# EAGLE design ict_to_hid (EAGLE 8.0.2)
AUTHOR: Brad Campbell; REV: A; TITLE: Bill Acceptor Adapter
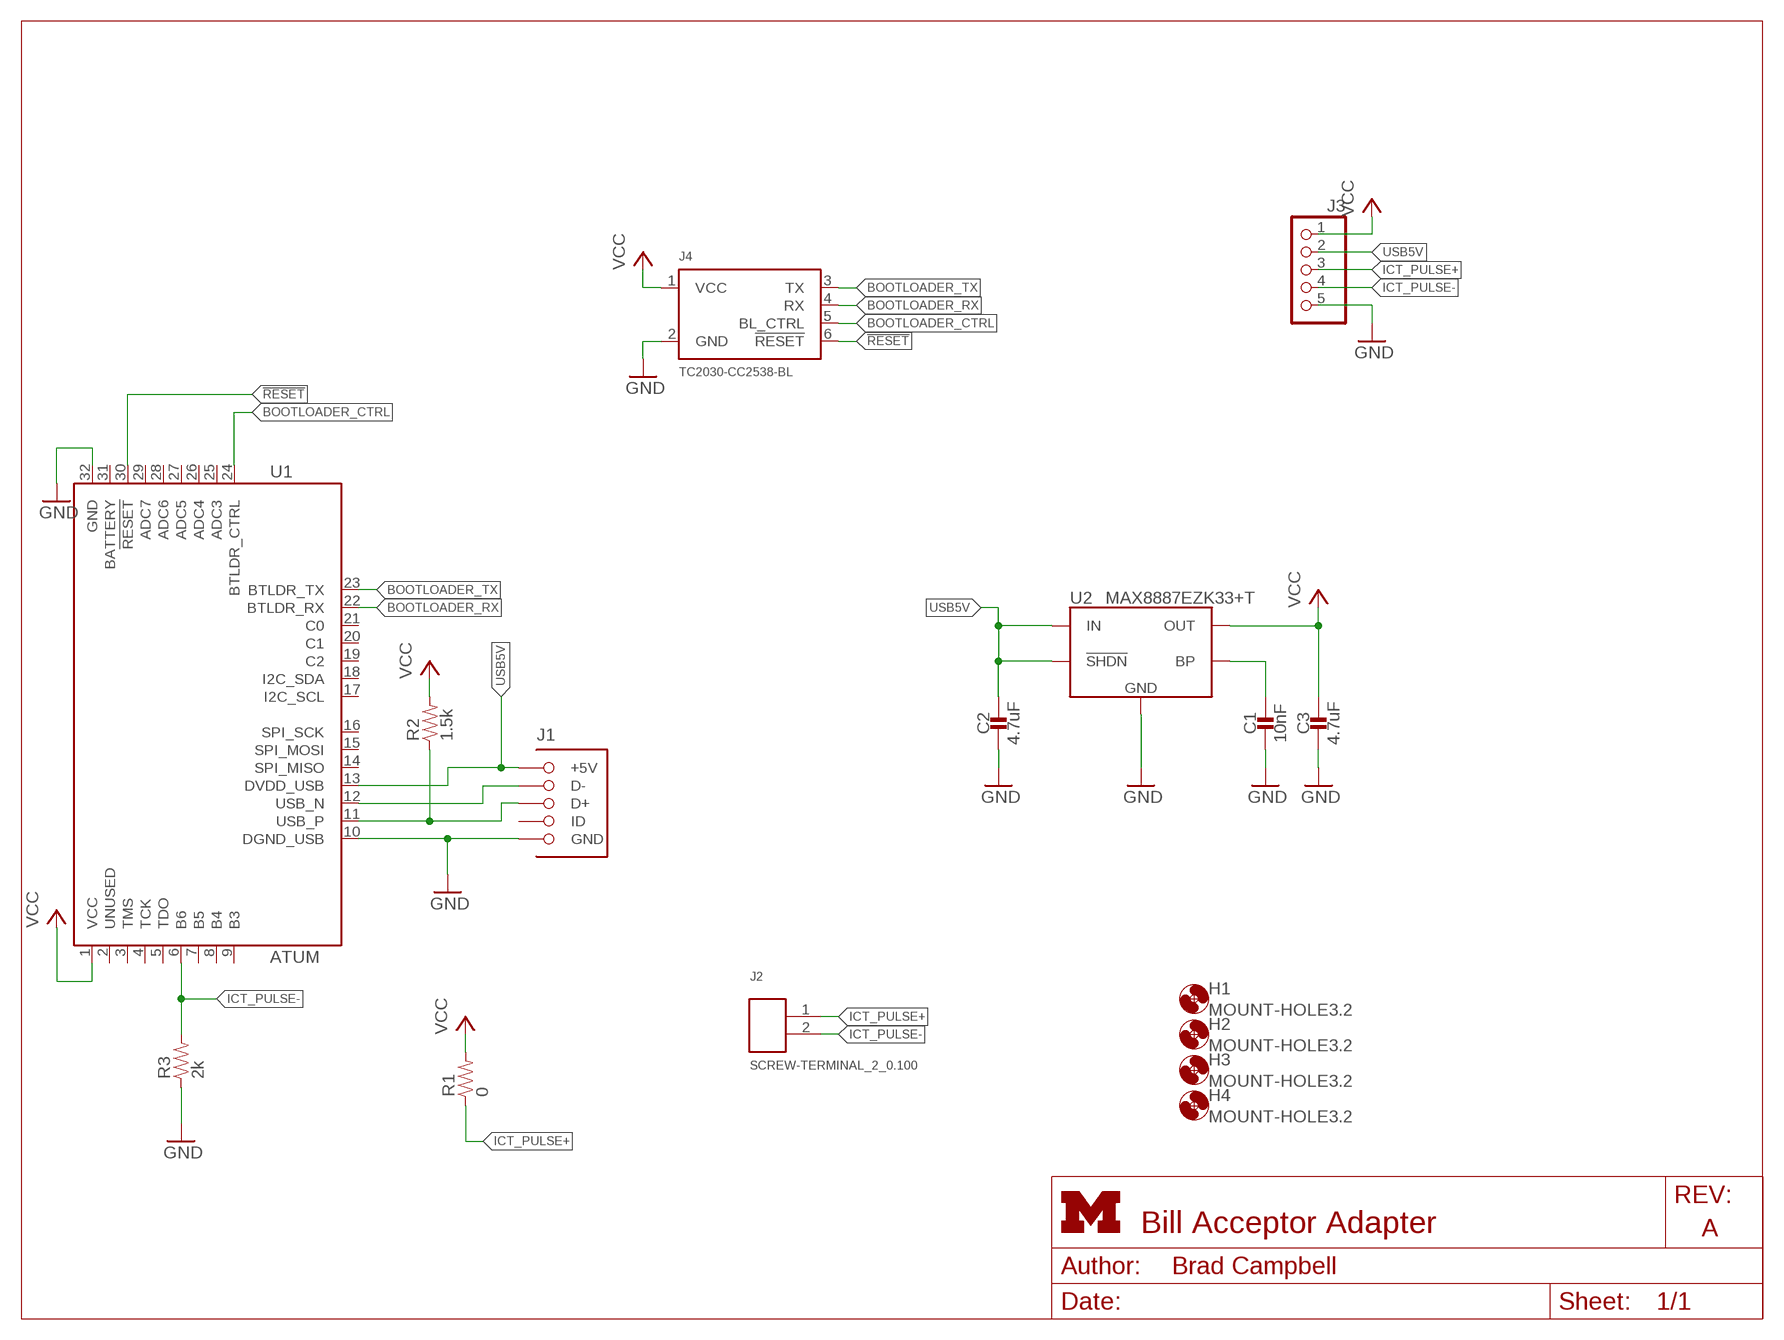
[diagram p0: schematic, sheet 1]
FRAME1 (LETTER_L): HEIGHT: 8.5in; WIDTH: 11in

## Parts
C1  10nF  CAPACITOR0603_CAP  [0603_CAP]
C2  4.7uF  CAPACITOR0603_CAP  [0603_CAP]
C3  4.7uF  CAPACITOR0603_CAP  [0603_CAP]
H1  MOUNT-HOLE3.2  [3,2]
H2  MOUNT-HOLE3.2  [3,2]
H3  MOUNT-HOLE3.2  [3,2]
H4  MOUNT-HOLE3.2  [3,2]
J1  MICRO_USB_B_HIROSE_ZX62R-B-5P  [USB_MICRO_B-HIROSE-ZX62R-B-5P]
J2  SCREW-TERMINAL_2_0.100  [CONN_BLOCK_2]
J3  PINHD-1X5  [1X05]
J4  TC2030-CC2538-BL  [TC2030-IDC]
R1  0  RESISTOR0603_RES  [0603-RES]
R2  1.5k  RESISTOR0603_RES  [0603-RES]
R3  2k  RESISTOR0603_RES  [0603-RES]
U1  ATUM  [ATUM]
U2  MAX8887EZK33+T  [SOT-23-5]

## Nets
!RESET: J4.6(!RESET) U1.30(!RESET)
BOOTLOADER_CTRL: J4.5(BL_CTRL) U1.24(BTLDR_CTRL)
BOOTLOADER_RX: J4.4(RX) U1.22(BTLDR_RX)
BOOTLOADER_TX: J4.3(TX) U1.23(BTLDR_TX)
GND: C1.2 C2.2 C3.2 J1.5(GND) J3.5 J4.2(GND) R3.1 U1.10(DGND_USB) U1.32(GND) U2.2(GND)
ICT_PULSE+: J2.1 J3.3 R1.1
ICT_PULSE-: J2.2 J3.4 R3.2 U1.6(B6)
N$5: C1.1 U2.4(BP)
N$11: J1.2(D-) U1.12(USB_N)
N$12: J1.3(D+) R2.1 U1.11(USB_P)
USB5V: C2.1 J1.1(+5V) J3.2 U1.13(DVDD_USB) U2.1(IN) U2.3(!SHDN)
VCC: C3.1 J3.1 J4.1(VCC) R1.2 R2.2 U1.1(VCC) U2.5(OUT)
Unconnected: J1.4(ID) U1.2(UNUSED) U1.3(TMS) U1.4(TCK) U1.5(TDO) U1.7(B5) U1.8(B4) U1.9(B3) U1.14(SPI_MISO) U1.15(SPI_MOSI) U1.16(SPI_SCK) U1.17(I2C_SCL) U1.18(I2C_SDA) U1.19(C2) U1.20(C1) U1.21(C0) U1.25(ADC3) U1.26(ADC4) U1.27(ADC5) U1.28(ADC6) U1.29(ADC7) U1.31(BATTERY)

## Library data of the parts
C1-C3 = passives:CAPACITOR: 0402 Capacitor
H1-H4 = holes:MOUNT-HOLE: MOUNTING HOLE with drill center marker
J1 = connector:MICRO_USB_B_HIROSE_ZX62R-B-5P: USB Micro B Connector Rounded side is up.; DIGIKEY: H11574CT-ND; MOUSER: 798-ZX62R-B-5P; NEWARK: 69W0714
J2 = headers:SCREW-TERMINAL_2_0.100: 2x 0.100 in screw terminal block; DIGIKEY: 277-1273-ND; MOUSER: 651-1725656; NEWARK: 71C4107
J3 = pinhead:PINHD-1X5: PIN HEADER
J4 = connector:TC2030-CC2538-BL: Tag connect programmer for the CC2538 bootloader. The RX/TX switch happens on the programmer board, so when using this connect the TX pin to the TX pin on the CC2538 and same for the RX.
R1-R3 = passives:RESISTOR: Resistor Basic schematic elements and footprints for 0603, 1206, and PTH resistors.
U1 = atum:ATUM: Atum sensorboard prototyping module.
U2 = chips:MAX8887: IC REG LDO 3.3V 0.3A TSOT23-5; DIGIKEY: MAX8887EZK33+TCT-ND

## Board
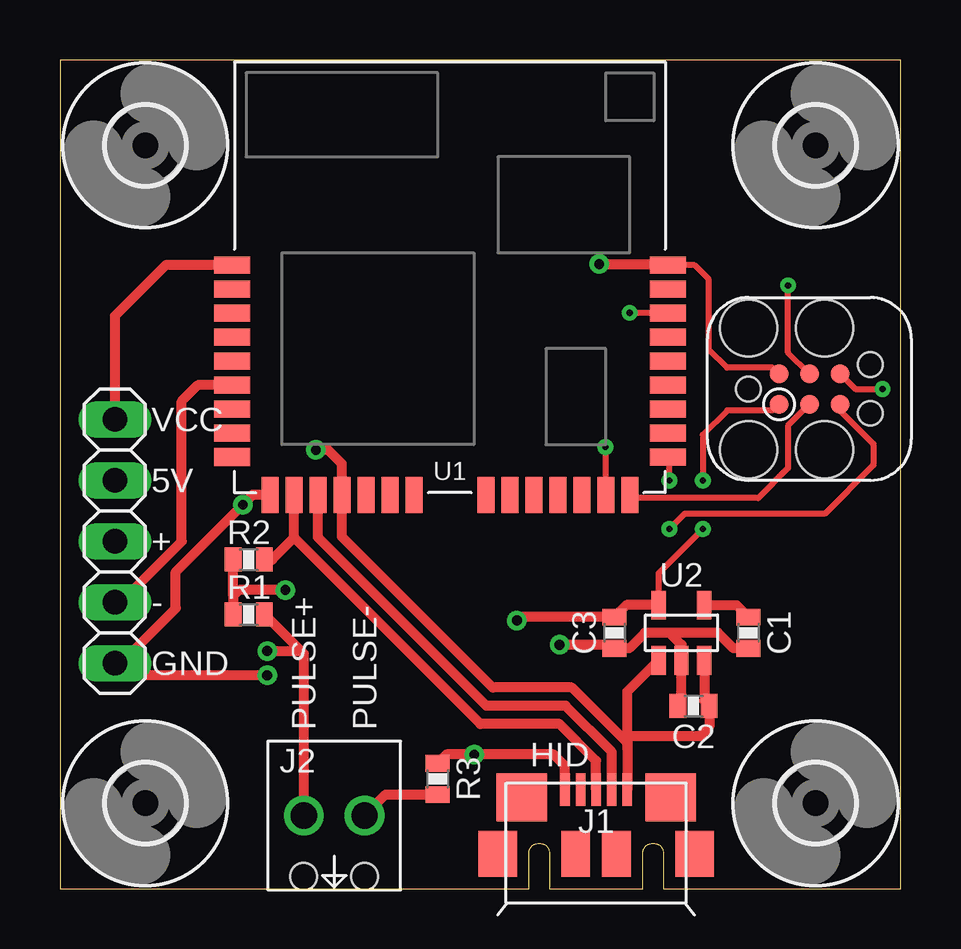
[diagram p1: board, top side]
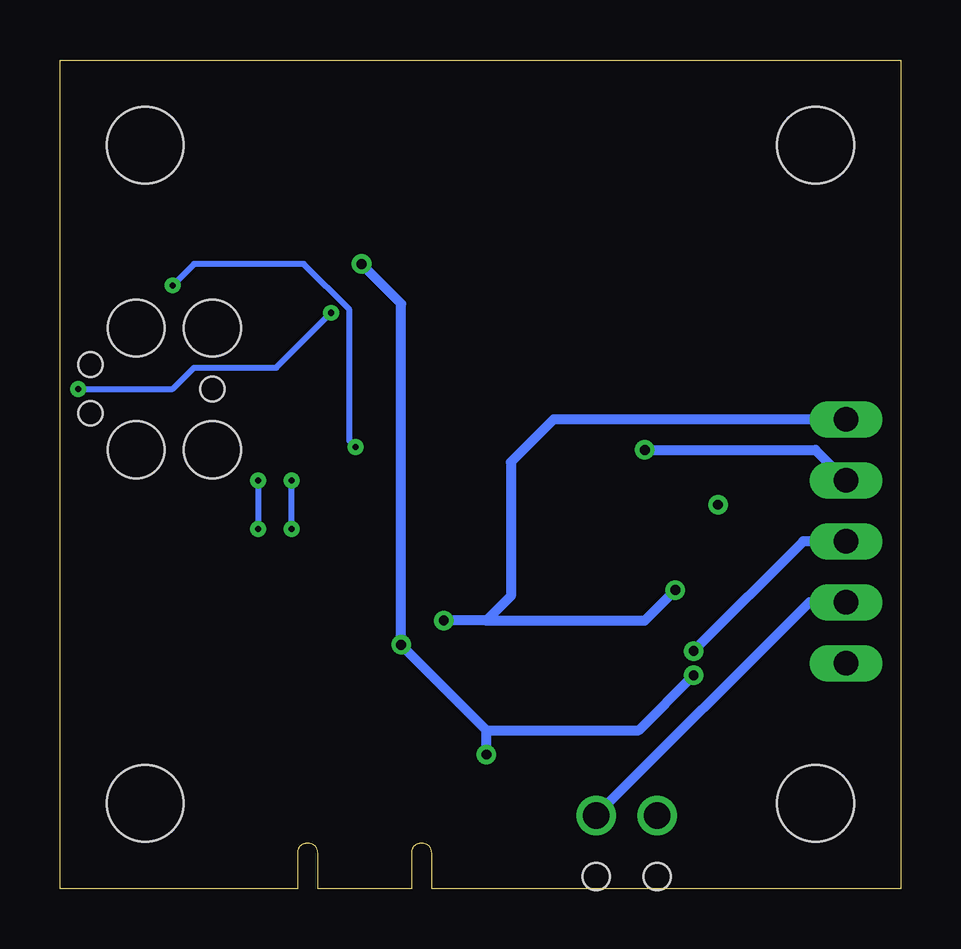
[diagram p2: board, bottom side, seen from below]

Size 35.05 x 34.54 mm. Coordinates in mm from the lower left corner, seen from the top.
Outline: 17.27,0 0,0 0,34.54 35.05,34.54 35.05,0 27.43,0
Copper layers (1*16): Top 0.0178mm / dielectric 59mil / Bottom 0.0178mm
Design rules "sunstone-2lyr_v1.0.0.3 *": minimum track width 6mil, minimum drill 10mil, track to track 6mil, track to pad 6mil, pad to pad 6mil, via to via 6mil, smd to smd 6mil, copper to edge 10mil, drill to drill 16mil, minimum pad ring 8mil, minimum via ring 8mil, stop-mask expansion 3mil, vias tented up to drill 50mil, thermal gap 10mil

### Footprints (pad centres in the part's own frame; a part is rotated, then mirrored left to right if it is on the bottom)
0603_CAP = smd 0.7 x 1: 1 -0.65,0; 2 0.65,0
3,2 = hole 3.2: 0,0
USB_MICRO_B-HIROSE-ZX62R-B-5P = smd 0.4 x 1.35: 1 1.3,4.125; 2 0.65,4.125; 3 0,4.125; 4 -0.65,4.125; 5 -1.3,4.125 | smd 2.1 x 2: P$1 3.1,3.8; P$2 -3.1,3.8 | smd 1.6 x 1.9: P$3 -4.1,1.45; P$6 4.1,1.45 | smd 1.2 x 1.9: P$4 -0.85,1.45; P$5 0.85,1.45
CONN_BLOCK_2 = drill 1.1: 1 -1.27,0; 2 1.27,0 | hole 1.12: -1.27,-2.54; 1.27,-2.54
1X05 = drill 1.016 long: 1 -5.08,0; 2 -2.54,0; 3 0,0; 4 2.54,0; 5 5.08,0
TC2030-IDC = smd 0.787 x 0.787: 1 -1.27,-0.635; 2 -1.27,0.635; 3 0,-0.635; 4 0,0.635; 5 1.27,-0.635; 6 1.27,0.635 | hole 2.375: -2.54,2.54; 0.635,2.54; 0.635,-2.54; -2.54,-2.54 | hole 1.016: -2.54,0; 2.54,1.016; 2.54,-1.016
0603-RES = smd 0.7 x 1: 1 -0.65,0; 2 0.65,0
ATUM = smd 0.7 x 1.5: 1 -9.479,-9.079; 2 -8.479,-9.079; 3 -7.479,-9.079; 4 -6.479,-9.079; 5 -5.479,-9.079; 6 -4.479,-9.079; 7 -3.479,-9.079; 8 -2.479,-9.079; 24 -1.479,9.079; 25 -2.479,9.079; 26 -3.479,9.079; 27 -4.479,9.079; 28 -5.479,9.079; 29 -6.479,9.079; 30 -7.479,9.079; 31 -8.479,9.079; 32 -9.479,9.079 | smd 0.754 x 1.5: 9 -1.479,-9.079 | smd 1.5 x 0.7: 10 0.1,-7.5; 11 0.1,-6.5; 12 0.1,-5.5; 13 0.1,-4.5; 14 0.1,-3.5; 15 0.1,-2.5; 16 0.1,-1.5; 17 0.1,1.5; 18 0.1,2.5; 19 0.1,3.5; 20 0.1,4.5; 21 0.1,5.5; 22 0.1,6.5; 23 0.1,7.5
SOT-23-5 = smd 0.6 x 1.2: 1 -0.95,-1.15; 2 0,-1.15; 3 0.95,-1.15; 4 0.95,1.15; 5 -0.95,1.15

### Placement (x,y rotation side)
C1  28.7,10.67 270 top
C2  26.42,7.62 180 top
C3  23.11,10.67 270 top
H1  3.56,3.56 0 top
H2  31.5,3.56 0 top
H3  3.56,30.99 0 top
H4  31.5,30.99 0 top
J1  22.35,0 0 top
J2  11.43,3.05 0 top
J3  2.29,14.48 270 top
J4  31.24,20.83 0 top
R1  7.87,11.43 180 top
R2  7.87,13.72 180 top
R3  15.75,4.57 270 top
U1  16.26,16.51 270 top
U2  25.91,10.67 0 top

### Tracks (layer width: path | path; a pad name or v marks a point on that pad's centre or on a via)
!RESET  (via drill 0.25)
  Top 0.254: J4.6 33.15,20.83 v34.29,20.83 | v23.75,24 25.32,24 U1.30
  Bottom 0.254: v34.29,20.83 30.35,20.83 29.46,21.72 26.04,21.72 v23.75,24
BOOTLOADER_CTRL  (via drill 0.25)
  Top 0.254: J4.5 32.51,19.94 33.91,18.54 33.91,17.65 31.88,15.62 26.04,15.62 v25.4,14.99 | v25.4,17.02 25.4,17.92 U1.24
  Bottom 0.254: v25.4,14.99 v25.4,17.02
BOOTLOADER_RX  (via drill 0.25)
  Top 0.254: J4.4 30.35,22.35 v30.35,25.15 | v22.73,18.41 22.73,16.43 U1.22
  Bottom 0.254: v22.73,18.41 22.99,18.67 22.99,24.13 24.89,26.04 29.46,26.04 v30.35,25.15
BOOTLOADER_TX
  Top 0.254: J4.3 30.35,19.3 30.35,17.53 29.11,16.28 23.88,16.28 U1.23
GND  (via drill 0.41)
  Top 0.254: J4.2 29.72,21.72 27.81,21.72 27.05,22.48 27.05,25.4 26.46,25.99 U1.32
  Top 0.406: J1.5 21.05,5.11 20.57,5.59 v17.27,5.59 16.11,5.59 R3.1 | C2.2 25.91,7.76 U2.2 25.91,10.16 25.4,10.67 | 25.4,10.67 24.38,10.67 23.73,10.02 C3.2 22.97,10.16 v20.83,10.16 | C1.2 28.08,10.02 27.43,10.67 25.4,10.67 | U1.10 8.03,16.41 v7.62,16 4.83,13.21 4.83,11.68 2.54,9.4 J3.5 2.79,8.89 v8.64,8.89 | v22.48,26.04 25.29,26.04 U1.32
  Bottom 0.406: 17.27,6.6 v20.83,10.16 20.83,24.38 v22.48,26.04 | 17.27,6.6 v17.27,5.59 17.27,5.84 | 17.27,6.6 10.92,6.6 v8.64,8.89
ICT_PULSE+  (via drill 0.41)
  Top 0.406: 10.16,9.79 J2.1 | 10.16,9.79 R1.1 | v8.64,9.91 10.05,9.91 10.16,9.79
  Bottom 0.406: J3.3 4.06,14.48 v8.64,9.91
ICT_PULSE-
  Top 0.406: J2.2 13.57,3.92 R3.2 | U1.6 5.75,20.99 5.08,20.32 5.08,14.48 2.54,11.94 J3.4
  Bottom 0.406: J3.4 3.81,11.94 J2.2
N$5
  Top 0.406: U2.4 28.2,11.82 C1.1
N$11
  Top 0.406: J1.2 23,5.7 21.08,7.62 17.78,7.62 10.76,14.64 U1.12
N$12
  Top 0.406: J1.3 22.35,5.33 20.83,6.86 17.53,6.86 9.76,14.63 | 9.76,14.63 U1.11 | R2.1 8.84,13.72 9.76,14.63
USB5V  (via drill 0.41)
  Top 0.406: U2.1 23.65,8.21 23.65,6.35 | U2.3 26.86,7.83 C2.1 27.07,6.75 26.67,6.35 23.65,6.35 | 23.65,5.84 J1.1 | 23.65,5.84 23.65,6.07 21.34,8.38 18.03,8.38 11.76,14.66 U1.13 11.76,17.71 11.18,18.29 v10.67,18.29 | 23.65,6.35 23.65,5.84
  Bottom 0.406: v10.67,18.29 3.56,18.29 J3.2
VCC  (via drill 0.25, 0.41)
  Top 0.254: J4.1 29.72,19.94 27.81,19.94 26.8,18.92 v26.8,17.02 | v26.8,14.99 24.96,13.15 U2.5
  Top 0.406: U2.5 23.61,11.82 C3.1 19.19,11.32 v19.05,11.18 | U1.1 4.4,25.99 2.29,23.88 J3.1 | 7.22,12.19 R1.2 | 7.22,12.19 R2.2 | v9.4,12.45 7.48,12.45 7.22,12.19
  Bottom 0.254: v26.8,17.02 v26.8,14.99
  Bottom 0.406: 17.27,11.18 v19.05,11.18 | 17.27,11.18 10.67,11.18 v9.4,12.45 | J3.1 14.48,19.56 16.26,17.78 16.26,12.19 17.27,11.18

### Text on the board
tPlace: VCC | 5V | + | - | GND | PULSE+ | PULSE- | HID